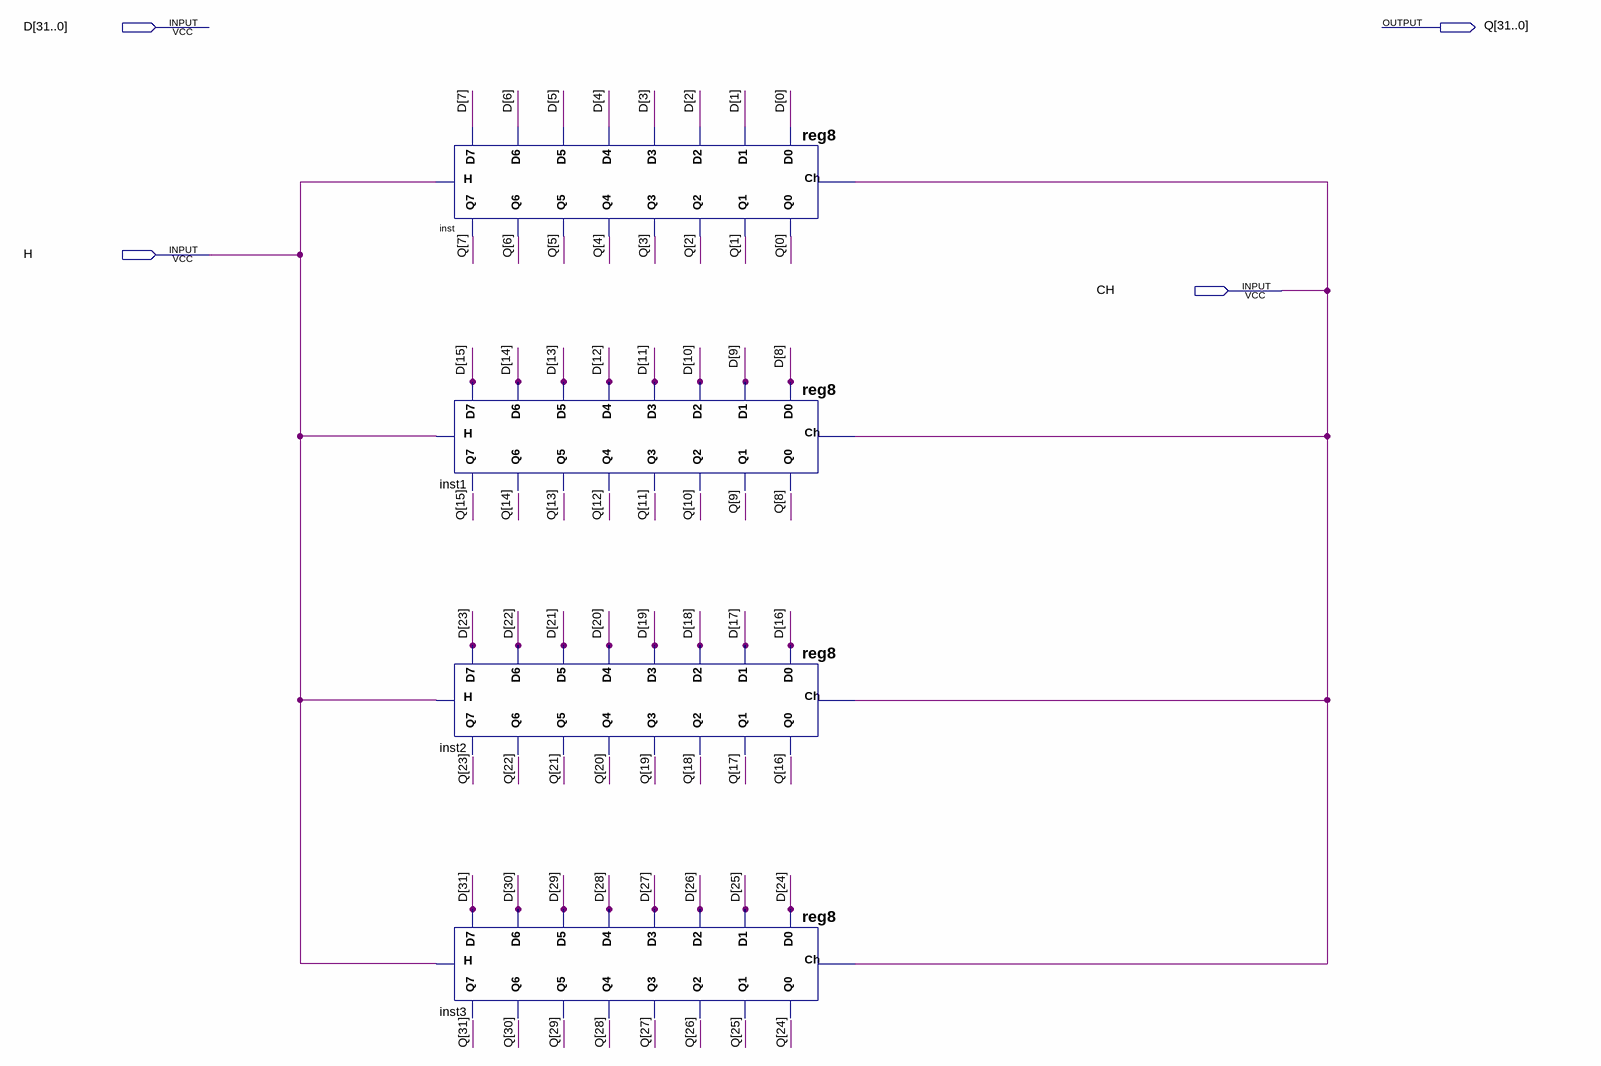
[diagram p0: schematic sheet]
// Quartus schematic reg32.bdf as structural Verilog: 4 symbols, 4 pins
module reg32 (
  input  [31:0] D,
  input  H,
  input  CH,
  output [31:0] Q
);

  reg8 inst (
    .D0(D[0]), .D7(D[7]), .D6(D[6]), .D5(D[5]), .D4(D[4]), .D3(D[3]), .D2(D[2]), .D1(D[1]), .H(H), .Ch(CH),
    .Q0(Q[0]), .Q1(Q[1]), .Q2(Q[2]), .Q3(Q[3]), .Q4(Q[4]), .Q5(Q[5]), .Q6(Q[6]), .Q7(Q[7]));
  reg8 inst1 (
    .D0(D[8]), .D7(D[15]), .D6(D[14]), .D5(D[13]), .D4(D[12]), .D3(D[11]), .D2(D[10]), .D1(D[9]), .H(H),
    .Ch(CH));  // open: Q0, Q1, Q2, Q3, Q4, Q5, Q6, Q7
  reg8 inst2 (
    .D0(D[16]), .D7(D[23]), .D6(D[22]), .D5(D[21]), .D4(D[20]), .D3(D[19]), .D2(D[18]), .D1(D[17]), .H(H),
    .Ch(CH));  // open: Q0, Q1, Q2, Q3, Q4, Q5, Q6, Q7
  reg8 inst3 (
    .D0(D[24]), .D7(D[31]), .D6(D[30]), .D5(D[29]), .D4(D[28]), .D3(D[27]), .D2(D[26]), .D1(D[25]), .H(H),
    .Ch(CH));  // open: Q0, Q1, Q2, Q3, Q4, Q5, Q6, Q7
endmodule
